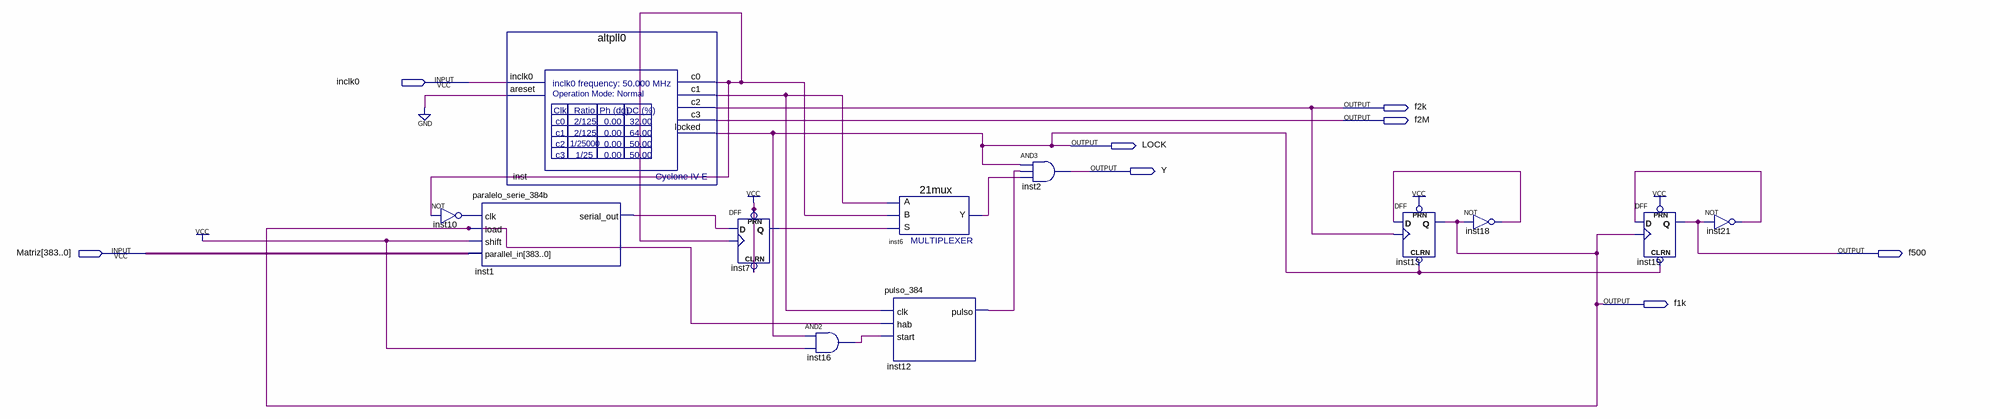
[diagram p0: schematic sheet]
// Quartus schematic Block1.bdf as structural Verilog: 12 symbols, 8 pins
module Block1 (
  input  inclk0,
  input  [383:0] Matriz,
  output f2k,
  output f2M,
  output LOCK,
  output Y,
  output f500,
  output f1k
);

  wire inst1_serial_out, inst6_y, inst7_q, inst10_out, inst12_pulso, inst16_out, inst18_out, inst21_out,
       inst_c0, inst_c1;

  not inst10 (inst10_out, inst_c0);
  paralelo_serie_384b inst1 (
    .clk(inst10_out), .load(f1k), .shift(1'b1), .parallel_in(Matriz), .serial_out(inst1_serial_out));
  altpll0 inst (.inclk0(inclk0), .areset(1'b0), .c0(inst_c0), .c1(inst_c1), .c2(f2k), .c3(f2M), .locked(LOCK));
  DFF inst7 (.CLRN(1'b1), .CLK(inst_c0), .D(inst1_serial_out), .PRN(1'b1), .Q(inst7_q));
  and inst16 (inst16_out, LOCK, 1'b1);
  \21mux  inst6 (.S(inst7_q), .B(inst_c0), .A(inst_c1), .Y(inst6_y));
  pulso_384 inst12 (.clk(inst_c1), .hab(f1k), .start(inst16_out), .pulso(inst12_pulso));
  and inst2 (Y, LOCK, inst12_pulso, inst6_y);
  DFF inst13 (.CLRN(LOCK), .CLK(f2k), .D(inst18_out), .PRN(1'b1), .Q(f1k));
  not inst18 (inst18_out, f1k);
  DFF inst19 (.CLRN(LOCK), .CLK(f1k), .D(inst21_out), .PRN(1'b1), .Q(f500));
  not inst21 (inst21_out, f500);
endmodule
